# Altium project stm32f107rct7_devbrd.PrjPCB
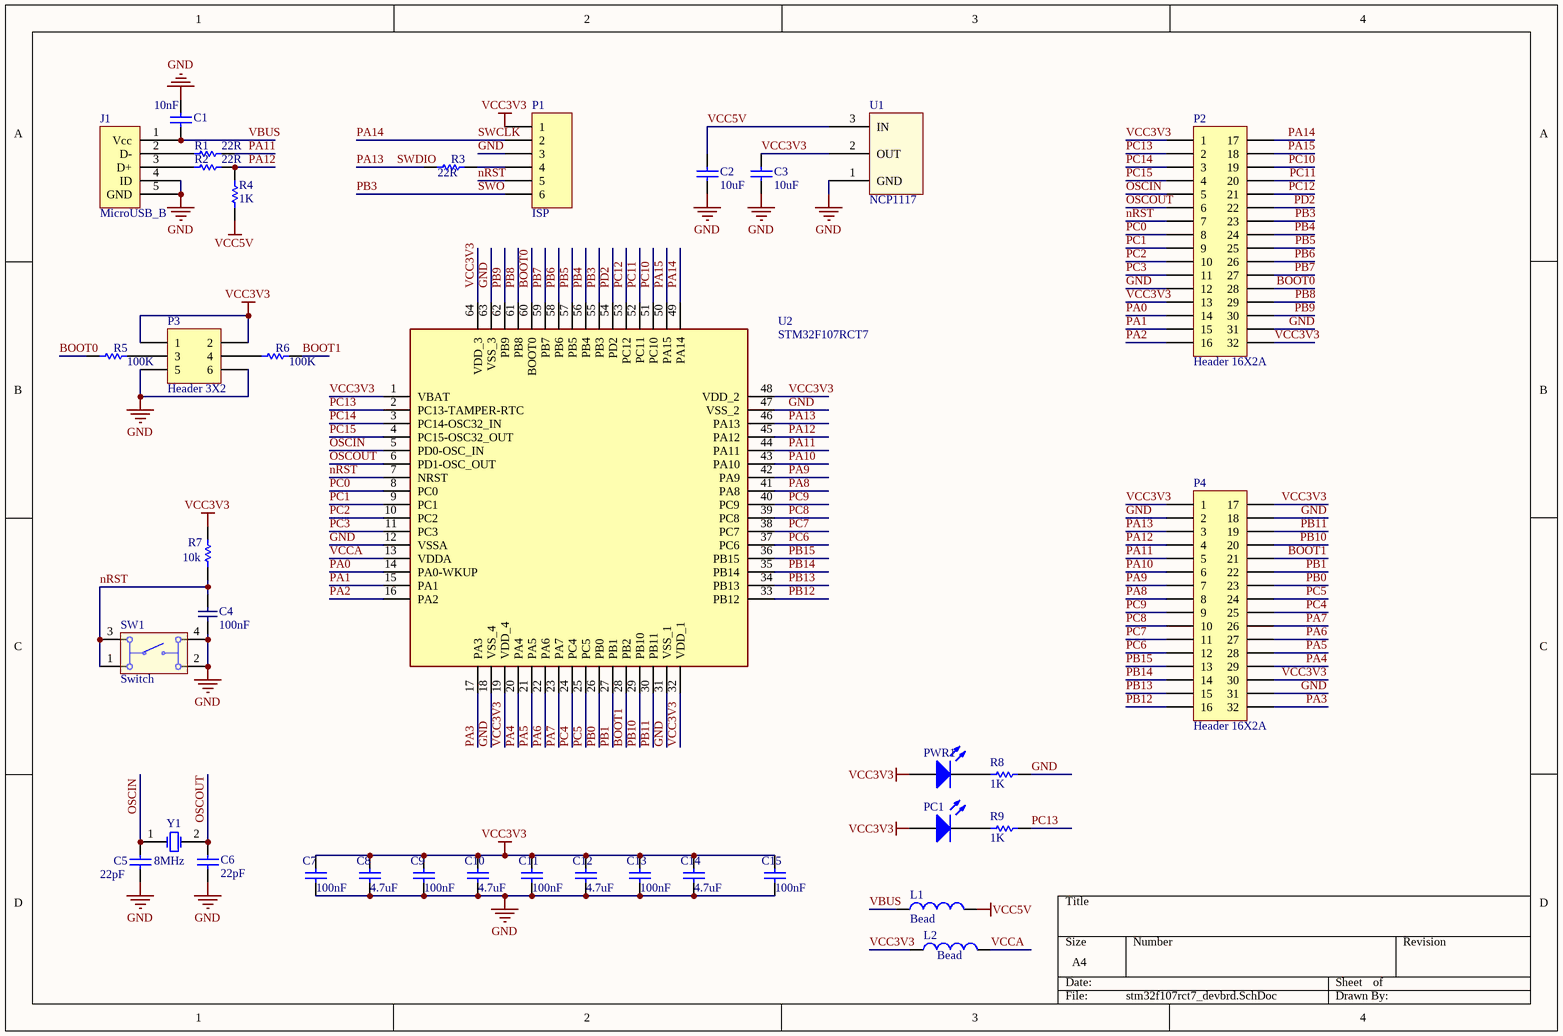
[diagram p0: stm32f107rct7_devbrd.SchDoc]
1 sheet, 37 parts. Net scope: global (net labels, ports and power ports of the same name join across sheets).
Board file: stm32f107rct7_devbrd.PcbDoc

## Sheet stm32f107rct7_devbrd.SchDoc
size A4

### Parts
C1  10nF  [SMD0805_CAP]
C2  10uF  [SMD0805_CAP]
C3  10uF  [SMD0805_CAP]
C4  100nF  [SMD0805_CAP]
C5  22pF  [SMD0805_CAP]
C6  22pF  [SMD0805_CAP]
C7  100nF  [SMD0805_CAP]
C8  4.7uF  [SMD0805_CAP]
C9  100nF  [SMD0805_CAP]
C10  4.7uF  [SMD0805_CAP]
C11  100nF  [SMD0805_CAP]
C12  4.7uF  [SMD0805_CAP]
C13  100nF  [SMD0805_CAP]
C14  4.7uF  [SMD0805_CAP]
C15  100nF  [SMD0805_CAP]
J1  MicroUSB_B  [micro_usb_molex_105017-0001]
L1  Bead  [SMD0805]
L2  Bead  [SMD0805]
P1  ISP  [ISP]
P2  Header 16X2A  [HDR2X16_CEN]
P3  Header 3X2  [HDR2X3]
P4  Header 16X2A  [HDR2X16_CEN]
PC1  LED0  [LED]  (value not drawn)
PWR1  LED0  [LED]  (value not drawn)
R1  22R  [SMD0805]
R2  22R  [SMD0805]
R3  22R  [SMD0805]
R4  1K  [SMD0805]
R5  100K  [SMD0805]
R6  100K  [SMD0805]
R7  value 10k  [SMD0805]  (hidden comment: 100K)
R8  1K  [SMD0805]
R9  1K  [SMD0805]
SW1  Switch  [430156050726]
U1  NCP1117  [SOT-223-2]
U2  STM32F107RCT7  [QFP50P1200X1200X160-64N]
Y1  8MHz  [XTAL]

### Nets
GND: C1.2 C2.1 C3.1 C4.2 C5.2 C6.2 C7.1 C8.1 C9.1 C10.1 C11.1 C12.1 C13.1 C14.1 C15.1 J1.4(ID) J1.5(GND) P1.3 P2.12 P2.31 P3.5 P3.6 P4.2 P4.18 P4.31 R8.1 SW1.2 SW1.4 U1.1(GND) U2.12(VSSA) U2.18(VSS_4) U2.31(VSS_1) U2.47(VSS_2) U2.63(VSS_3)
VCC3V3: C3.2 C7.2 C8.2 C9.2 C10.2 C11.2 C12.2 C13.2 C14.2 C15.2 L2.1 P1.1 P2.1 P2.13 P2.32 P3.1 P3.2 P4.1 P4.17 P4.30 PC1.1(A) PWR1.1(A) R7.2 U1.2(OUT) U2.1(VBAT) U2.19(VDD_4) U2.32(VDD_1) U2.48(VDD_2) U2.64(VDD_3)
VCC5V: C2.2 L1.2 R4.1 U1.3(IN)
BOOT0: P2.28 R5.1 U2.60(BOOT0)
BOOT1: P4.21 R6.2 U2.28(PB2)
nRST: C4.1 P1.5 P2.7 R7.1 SW1.1 SW1.3 U2.7(NRST)
OSCIN: C5.1 P2.5 U2.5(PD0-OSC_IN) Y1.1(OSC1)
OSCOUT: C6.1 P2.6 U2.6(PD1-OSC_OUT) Y1.2(OSC2)
PA0: P2.14 U2.14(PA0-WKUP)
PA1: P2.15 U2.15(PA1)
PA2: P2.16 U2.16(PA2)
PA3: P4.32 U2.17(PA3)
PA4: P4.29 U2.20(PA4)
PA5: P4.28 U2.21(PA5)
PA6: P4.27 U2.22(PA6)
PA7: P4.26 U2.23(PA7)
PA8: P4.8 U2.41(PA8)
PA9: P4.7 U2.42(PA9)
PA10: P4.6 U2.43(PA10)
PA11: P4.5 R1.2 U2.44(PA11)
PA12: P4.4 R2.2 R4.2 U2.45(PA12)
PA13: P4.3 R3.1 U2.46(PA13)  [also labelled SWDIO]
PA14: P1.2 P2.17 U2.49(PA14)  [also labelled SWCLK]
PA15: P2.18 U2.50(PA15)
PB0: P4.23 U2.26(PB0)
PB1: P4.22 U2.27(PB1)
PB3: P1.6 P2.23 U2.55(PB3)  [also labelled SWO]
PB4: P2.24 U2.56(PB4)
PB5: P2.25 U2.57(PB5)
PB6: P2.26 U2.58(PB6)
PB7: P2.27 U2.59(PB7)
PB8: P2.29 U2.61(PB8)
PB9: P2.30 U2.62(PB9)
PB10: P4.20 U2.29(PB10)
PB11: P4.19 U2.30(PB11)
PB12: P4.16 U2.33(PB12)
PB13: P4.15 U2.34(PB13)
PB14: P4.14 U2.35(PB14)
PB15: P4.13 U2.36(PB15)
PC0: P2.8 U2.8(PC0)
PC1: P2.9 U2.9(PC1)
PC2: P2.10 U2.10(PC2)
PC3: P2.11 U2.11(PC3)
PC4: P4.25 U2.24(PC4)
PC5: P4.24 U2.25(PC5)
PC6: P4.12 U2.37(PC6)
PC7: P4.11 U2.38(PC7)
PC8: P4.10 U2.39(PC8)
PC9: P4.9 U2.40(PC9)
PC10: P2.19 U2.51(PC10)
PC11: P2.20 U2.52(PC11)
PC12: P2.21 U2.53(PC12)
PC13: P2.2 R9.1 U2.2(PC13-TAMPER-RTC)
PC14: P2.3 U2.3(PC14-OSC32_IN)
PC15: P2.4 U2.4(PC15-OSC32_OUT)
PD2: P2.22 U2.54(PD2)
VBUS: C1.1 J1.1(Vcc) L1.1
VCCA: L2.2 U2.13(VDDA)
NetJ1_2: J1.2(D-) R1.1
NetJ1_3: J1.3(D+) R2.1
NetP1_4: P1.4 R3.2
NetP3_3: P3.3 R5.2
NetP3_4: P3.4 R6.1
NetPC1_2: PC1.2(K) R9.2
NetPWR1_2: PWR1.2(K) R8.2

### Library data of the parts
C1-C3 C5-C15 = Cap Semi: Capacitor (Semiconductor SIM Model); Published: 8-Jun-2000; LatestRevisionDate: 29-May-2009; LatestRevisionNote: IPC-7351 Footprint Added.; PackageReference: C1206; Publisher: Altium Limited; PackageDescription: Chip Capacitor
  C1: Value: 10nF
  C2 C3: Value: 10uF
  C5 C6: Value: 22pF
  C7 C9 C11 C13 C15: Value: 100nF
  C8 C10 C12 C14: Value: 4.7uF
C4 = Cap: Capacitor (Semiconductor SIM Model); Value: 100nF
L1 = Inductor: Code_IEC: 1005; Published: 8-Jun-2000; LatestRevisionDate: 29-May-2009; LatestRevisionNote: IPC-7351 Footprint Added.; PackageReference: 0402-A; Publisher: Altium Limited; PackageDescription: Chip Inductor; Code_JEITA: 0402; Value: Bead
L2 = Inductor: Code_IEC: 1005; Value: 10mH; Published: 8-Jun-2000; LatestRevisionDate: 29-May-2009; LatestRevisionNote: IPC-7351 Footprint Added.; PackageReference: 0402-A; Publisher: Altium Limited; PackageDescription: Chip Inductor; Code_JEITA: 0402
P1 = MHDR1X6: Header, 6-Pin; LatestRevisionDate: 17-Jul-2002; LatestRevisionNote: Re-released for DXP Platform.; Publisher: Altium Limited
P2 P4 = Header 16X2A: Header, 16-Pin, Dual row; LatestRevisionDate: 17-Jul-2002; LatestRevisionNote: Re-released for DXP Platform.; Publisher: Altium Limited
P3 = Header 3X2: Header, 3-Pin, Dual row; LatestRevisionDate: 17-Jul-2002; LatestRevisionNote: Re-released for DXP Platform.; Publisher: Altium Limited
PC1 PWR1 = LED0: Typical INFRARED GaAs LED; Published: 8-Jun-2000; LatestRevisionDate: 08-Jul-2005; LatestRevisionNote: Mech Layer 1 removed.; PackageReference: LED-0; Publisher: Altium Limited; PackageDescription: LED; 2 Leads
R1-R6 R8 R9 = Res Semi: Semiconductor Resistor; Published: 8-Jun-2000; LatestRevisionDate: 17-Jul-2002; LatestRevisionNote: Re-released for DXP Platform.; PackageReference: AXIAL-0.5; Publisher: Altium Limited; PackageDescription: Axial Device, Thru-Hole; 2 Leads; 0.5 in Pin Spacing
  R1-R3: Value: 22R
  R4 R8 R9: Value: 1K
  R5 R6: Value: 100K
R7 = Res: Semiconductor Resistor
SW1 = 430156050726: WS-TATV THT Tact Switch 6X6 mm; NoPins: 04; PackageReference: 430156050726; PartNumber: 430156050726; ComponentLink1Description: Manufacturer URL; ComponentLink1URL: http://www.we-online.com; ComponentLink2Description: Datasheet; ComponentLink2URL: http://katalog.we-online.de/em/datasheet/4301x6.pdf
U1 = NCP1117: IC REG 5V 1A DPAC
U2 = STM32F107RCT7: Integrated Circuit; Manufacturer_Name: STMicroelectronics; Datasheet Link: https://componentsearchengine.com//STM32F107RCT7.pdf; Height: 1.6mm; Mouser2 Part Number: 511-STM32F107RCT7; Mouser2 Price/Stock: https://www.mouser.com/Search/Refine.aspx?Keyword=511-STM32F107RCT7; Manufacturer_Part_Number: STM32F107RCT7
Y1 = XTAL: Crystal Oscillator 8MHz; Published: 8-Jun-2000; LatestRevisionDate: 17-Jul-2002; LatestRevisionNote: Re-released for DXP Platform.; PackageReference: R38; Publisher: Altium Limited; PackageDescription: Crystal, Thru-Hole; 2 Leads; Body 3.1 x 8.2 mm (Dia.xH)